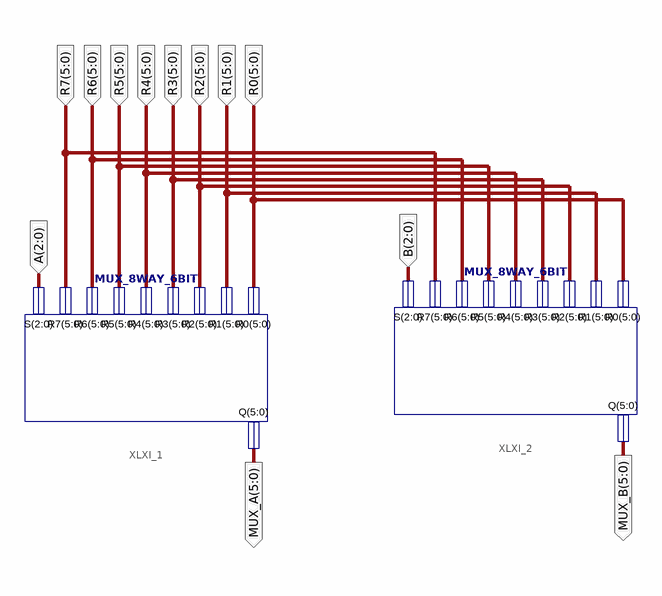
[diagram p0: schematic sheet 1]
// Xilinx ISE schematic MUX_8WAY_6BITS_2.sch (spartan3e) as structural Verilog: 2 symbols, 13 ports
module MUX_8WAY_6BITS_2 (
  input  [5:0] XLXN_1,
  input  [5:0] R1,
  input  [5:0] R2,
  input  [5:0] R3,
  input  [5:0] R4,
  input  [5:0] R5,
  input  [5:0] R6,
  input  [5:0] R7,
  input  [2:0] A,
  input  [2:0] B,
  input  [5:0] R0,
  output [5:0] MUX_A,
  output [5:0] MUX_B
);

  MUX_8WAY_6BIT XLXI_1 (.Q(MUX_A), .R0(R0), .R1(R1), .R2(R2), .R3(R3), .R4(R4), .R5(R5), .R6(R6), .R7(R7), .S(A));
  MUX_8WAY_6BIT XLXI_2 (.Q(MUX_B), .R0(R0), .R1(R1), .R2(R2), .R3(R3), .R4(R4), .R5(R5), .R6(R6), .R7(R7), .S(B));
endmodule
